# EAGLE schematic iPot (EAGLE 6.5.0)
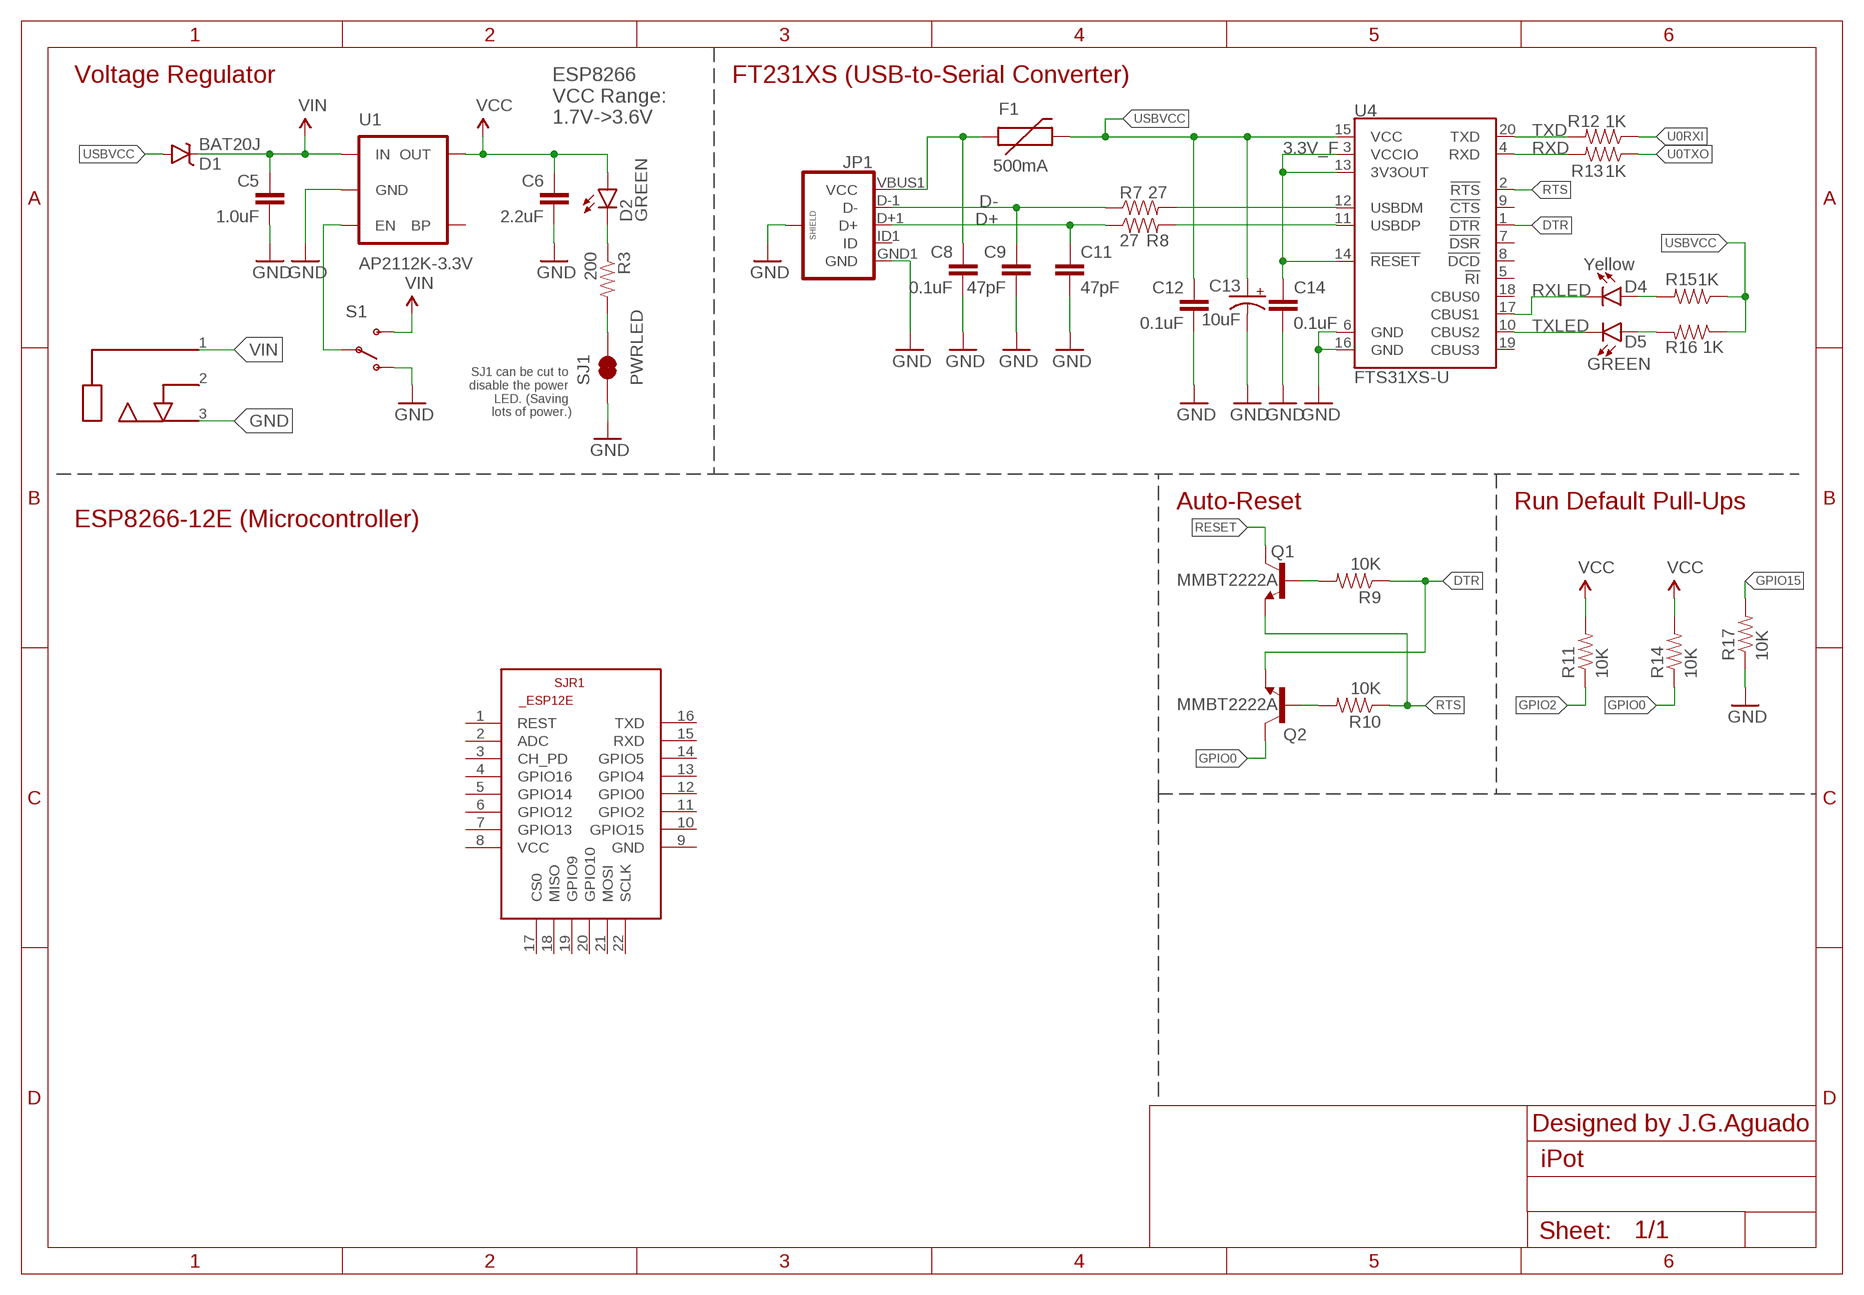
[diagram p0: schematic, sheet 1]

## Parts
C5  1.0uF  1.0UF-25V-+80/-20(0805)  [0805]
C6  2.2uF  2.2UF-10V-20%(0603)  [0603-CAP]
C8  0.1uF  0.1UF-25V(+80/-20%)(0603)  [0603-CAP]
C9  47pF  47PF-50V-5%(0603)  [0603-CAP]
C11  47pF  47PF-50V-5%(0603)  [0603-CAP]
C12  0.1uF  0.1UF-25V(+80/-20%)(0603)  [0603-CAP]
C13  10uF  10UF-16V-10%(TANT)  [EIA3216]
C14  0.1uF  0.1UF-25V(+80/-20%)(0603)  [0603-CAP]
D1  BAT20J  DIODE-SCHOTTKY-BAT20J  [SOD-323]
D2  GREEN  LED-RED0603  [LED-0603]
D4  Yellow  LED-YELLOW0603  [LED-0603]
D5  GREEN  LED-GREEN0603  [LED-0603]
F1  500mA  PTCSMD  [PTC-1206]
JP1  USB_MICROB_PLUGCONN-11752  [USB-B-MICRO-SMD_V03]
JP2  DC_JACK_1.3  [DC_JACK_1.3]
Q1  MMBT2222A  TRANSISTOR_NPNMMBT2222A  [SOT23-3]
Q2  MMBT2222A  TRANSISTOR_NPNMMBT2222A  [SOT23-3]
R3  200  200OHM1/10W1%(0603)  [0603-RES]
R7  27  27OHM1/10W1%(0603)0603-RES  [0603-RES]
R8  27  27OHM1/10W1%(0603)0603-RES  [0603-RES]
R9  10K  10KOHM1/10W1%(0603)0603  [0603-RES]
R10  10K  10KOHM1/10W1%(0603)0603  [0603-RES]
R11  10K  10KOHM1/10W1%(0603)0603  [0603-RES]
R12  1K  1KOHM-1/10W-1%(0603)  [0603-RES]
R13  1K  1KOHM-1/10W-1%(0603)  [0603-RES]
R14  10K  10KOHM1/10W1%(0603)0603  [0603-RES]
R15  1K  1KOHM-1/10W-1%(0603)  [0603-RES]
R16  1K  1KOHM-1/10W-1%(0603)  [0603-RES]
R17  10K  10KOHM1/10W1%(0603)0603  [0603-RES]
S1  SWITCH-SPDT-SMD-A  [SWITCH-SPST-SMD-A]
SJ1  PWRLED  JUMPER-PAD-2-NC_BY_TRACE  [PAD-JUMPER-2-NC_BY_TRACE_YES_SILK]
SJR1  ESP8266-12EESP12E  [ESP8266-ESP12E]
U1  AP2112K-3.3V  V_REG_LDOSMD  [SOT23-5]
U4  FTS31XS-U  FT231XS  [SSOP20_L]

## Nets
3.3V_F: C14.1 U4.3(VCCIO) U4.13(3V3OUT) U4.14(!RESET)
D+: C11.1 JP1.D+1(D+) R8.1
D-: C9.1 JP1.D-1(D-) R7.1
DTR: Q2.2(E) R9.1 U4.1(!DTR)
GND: C5.2 C6.2 C8.2 C9.2 C11.2 C12.2 C13.C(-) C14.2 JP1.GND1(GND) JP1.SHIELD1(SHIELD) JP1.SHIELD2(SHIELD) JP1.SHIELD3(SHIELD) JP2.3 R17.1 S1.1(O) SJ1.1 U1.2(GND) U4.6(GND) U4.16(GND)
GPIO0: Q2.3(C) R14.1
GPIO2: R11.1
GPIO15: R17.2
N$4: R7.2 U4.12(USBDM)
N$5: R3.2 SJ1.2
N$6: Q1.1(B) R9.2
N$7: R8.2 U4.11(USBDP)
N$8: D5.A R16.2
N$10: D4.A R15.2
N$11: D2.C R3.1
N$12: Q2.1(B) R10.2
N$14: S1.2(P) U1.3(EN)
RESET: Q1.3(C)
RTS: Q1.2(E) R10.1 U4.2(!RTS)
RXD: R13.2 U4.4(RXD)
RXLED: D4.C U4.17(CBUS1)
TXD: R12.2 U4.20(TXD)
TXLED: D5.C U4.10(CBUS2)
U0RXI: R12.1
U0TXO: R13.1
USBVCC: C12.1 C13.A(+) D1.A F1.2 R15.1 R16.1 U4.15(VCC)
VCC: C6.1 D2.A R11.2 R14.2 U1.5(OUT)
VIN: C5.1 D1.C JP2.1 S1.3(S) U1.1(IN)
VUSB: C8.1 F1.1 JP1.VBUS1(VCC)
Unconnected: JP1.ID1(ID) JP2.2 SJR1.1(REST) SJR1.2(ADC) SJR1.3(CH_PD) SJR1.4(GPIO16) SJR1.5(GPIO14) SJR1.6(GPIO12) SJR1.7(GPIO13) SJR1.8(VCC) SJR1.9(GND) SJR1.10(GPIO15) SJR1.11(GPIO2) SJR1.12(GPIO0) SJR1.13(GPIO4) SJR1.14(GPIO5) SJR1.15(RXD) SJR1.16(TXD) SJR1.17(CS0) SJR1.18(MISO) SJR1.19(GPIO9) SJR1.20(GPIO10) SJR1.21(MOSI) SJR1.22(SCLK) U1.4(BP) U4.5(!RI) U4.7(!DSR) U4.8(!DCD) U4.9(!CTS) U4.18(CBUS0) U4.19(CBUS3)

## Notes on the sheet
- Voltage Regulator | FT231XS (USB-to-Serial Converter)
- ESP8266
  VCC Range:
  1.7V->3.6V
- SJ1 can be cut to 
  disable the power 
  LED. (Saving 
  lots of power.)
- Auto-Reset | Run Default Pull-Ups
- ESP8266-12E (Microcontroller)
- Designed by J.G.Aguado

## Library data of the parts
C5 = SparkFun-Capacitors:1.0UF-25V-+80/-20(0805): CAP-11625; PROD_ID: CAP-11625
C6 = SparkFun-Capacitors:2.2UF-10V-20%(0603): CAP-07888; PROD_ID: CAP-07888
C8 C12 C14 = SparkFun-Capacitors:0.1UF-25V(+80/-20%)(0603): CAP-00810 Ceramic Standard decoupling cap; PROD_ID: CAP-00810
C9 C11 = SparkFun-Capacitors:47PF-50V-5%(0603): CAP-08913; PROD_ID: CAP-08913
C13 = SparkFun-Capacitors:10UF-16V-10%(TANT): CAP-00811 1206/EIA-3216 Tantalum capacitor; PROD_ID: CAP-00811
D1 = SparkFun-DiscreteSemi:DIODE-SCHOTTKY: Schottky diodes in SFE's production catalog BAT20J 1A 23V 0.62Vf RB751 120mA 40V 0.37Vf PMEG4005EJ 0.5A 40V 0.42Vf MBRA140 1A 40V 0.5Vf B340A 3A 40V SMA; PROD_ID: DIO-11623
D2 = SparkFun-LED:LED-RED: Assorted Red LEDs LilyPad 1206- DIO-09912 1206- DIO-00809 0603- DIO-00819 "SMART" means more efficient and expensive; PROD_ID: DIO-00819; VALUE: RED
D4 = SparkFun-LED:LED-YELLOW: Yellow SMD LEDs LilyPad 1206- DIO-09909 0603- DIO-09003 "SMART" means more efficient and expensive; PROD_ID: DIO-09003
D5 = SparkFun-LED:LED-GREEN: Various green LEDs Green LEDs used in SFE Production 0603- DIO-00821 LARGE- DIO-00862 LILYPAD- DIO-09910; PROD_ID: DIO-00821
F1 = SparkFun-PowerIC:PTC: Resettable Fuse PTC Resettable Fuse. Spark Fun Electronics SKU : COM-08357; PROD_ID: RES-11150
JP1 = SparkFun-Connectors:USB_MICROB_PLUG: USB Micro-B connectors Some male, some female. Watch your step!; PROD_ID: CONN-11752
JP2 = SpaceDIY_connectors:DC_JACK_1.3
Q1 Q2 = SparkFun-DiscreteSemi:TRANSISTOR_NPN: Generic NPN BJT MMBT2222A - TRANS-08049 (SOT-23, 1A 40V) MPSA42 - TRANS-09116 (SOT-23, 500mA 300V) MMBT5088LT1G - TRANS-11160 (SOT-23, 50 mA 30V) BC547 - COM-08928 <http://www.sparkfun.com/products/8928> (TO-92 45V 100mA) (1.Collector 2.Base 3.Emitter) 2N3904 - COM-00521 <http://www.sparkfun.com/products/521> (TO-92 40V 200mA) (1.Emitter 2.Base 3.Collector) P2N2222A - COM-12852 <http://www.sparkfun.com/products/12852> (TO-92 40V 600mA) (1.Collector 2.Base 3.Emitter); PROD_ID: TRANS-08049
R3 = SparkFun-Resistors:200OHM1/10W1%(0603): RES-08220; PROD_ID: RES-08220
R7 R8 = SparkFun-Resistors:27OHM1/10W1%(0603): RES-09334; PROD_ID: RES-09334
R9-R11 R14 R17 = SparkFun-Resistors:10KOHM1/10W1%(0603): RES-00824; PROD_ID: RES-00824
R12 R13 R15 R16 = SparkFun-Resistors:1KOHM-1/10W-1%(0603): RES-07856; PROD_ID: RES-07856
S1 = SparkFun-Electromechanical:SWITCH-SPDT: SPDT Switch Simple slide switch, Spark Fun Electronics SKU : COM-00102 DPDT SMT slide switch, AYZ0202, SWCH-08179; PROD_ID: SWCH-10651
SJ1 = SparkFun-Passives:JUMPER-PAD-2-NC_BY_TRACE
SJR1 = SpaceDIY_boards:ESP8266-12E: ESP8266-12E Library for Eagle CAD The author not responsible for any damages or errors!. Created by Suhail jr.lt;/author>
U1 = SparkFun-PowerIC:V_REG_LDO: Voltage Regulator LDO Standard 150mA LDO voltage regulator in SOT-23 layout. Micrel part MIC5205. BP (by-pass) pin is used to lower output noise with 470pF cap.; PROD_ID: VREG-12457
U4 = SparkFun-DigitalIC:FT231X: FTDI FT231X Full Speed USB to Full-handshake UART This USB2.0 Full Speed IC offers a compact bridge to full handshake UART interfaces. The device is a UART, capable of operating up to 3MBaud, with low power consumption (8mA). The FT231X includes the complete FT-X series feature set and enables USB to be added into a system design quickly and easily over a UART interface.; PROD_ID: IC-11524